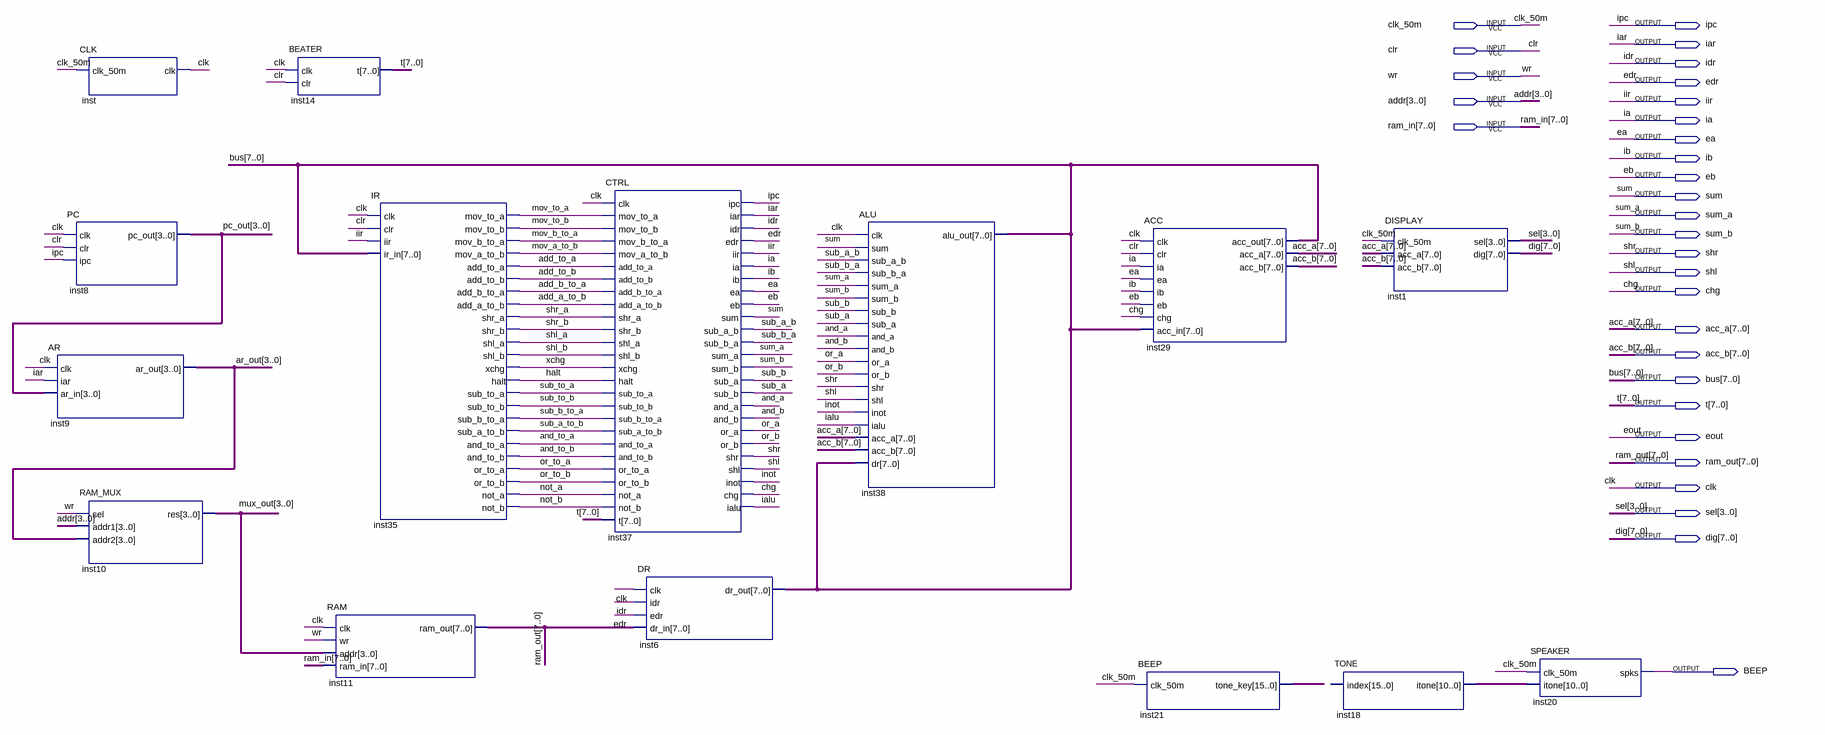
[diagram p0: schematic sheet]
// Quartus schematic COMPUTER.bdf as structural Verilog: 15 symbols, 30 pins
module COMPUTER (
  input  clk_50m,
  input  clr,
  input  wr,
  input  [3:0] addr,
  input  [7:0] ram_in,
  output ipc,
  output iar,
  output idr,
  output edr,
  output iir,
  output ia,
  output ea,
  output ib,
  output eb,
  output sum,
  output sum_a,
  output sum_b,
  output shr,
  output shl,
  output chg,
  output [7:0] acc_a,
  output [7:0] acc_b,
  output [7:0] bus,
  output [7:0] t,
  output eout,
  output [7:0] ram_out,
  output clk,
  output [3:0] sel,
  output [7:0] dig,
  output BEEP
);

  wire add_a_to_b, add_b_to_a, add_to_a, add_to_b, and_a, and_b, and_to_a, and_to_b, halt, ialu, inot,
       mov_a_to_b, mov_b_to_a, mov_to_a, mov_to_b, not_a, not_b, or_a, or_b, or_to_a, or_to_b, shl_a, shl_b,
       shr_a, shr_b, sub_a, sub_a_b, sub_a_to_b, sub_b, sub_b_a, sub_b_to_a, sub_to_a, sub_to_b, xchg;
  wire [3:0] ar_out, mux_out, pc_out;
  wire [10:0] inst18_itone;
  wire [15:0] inst21_tone_key;

  PC inst8 (.clk(clk), .clr(clr), .ipc(ipc), .pc_out(pc_out));
  AR inst9 (.clk(clk), .iar(iar), .ar_in(pc_out), .ar_out(ar_out));
  CLK inst (.clk_50m(clk_50m), .clk(clk));
  RAM_MUX inst10 (.sel(wr), .addr1(addr), .addr2(ar_out), .res(mux_out));
  BEATER inst14 (.clk(clk), .clr(clr), .t(t));
  IR inst35 (
    .clk(clk), .clr(clr), .iir(iir), .ir_in(bus), .mov_to_a(mov_to_a), .mov_to_b(mov_to_b),
    .mov_b_to_a(mov_b_to_a), .mov_a_to_b(mov_a_to_b), .add_to_a(add_to_a), .add_to_b(add_to_b),
    .add_b_to_a(add_b_to_a), .add_a_to_b(add_a_to_b), .shr_a(shr_a), .shr_b(shr_b), .shl_a(shl_a),
    .shl_b(shl_b), .xchg(xchg), .halt(halt), .sub_to_a(sub_to_a), .sub_to_b(sub_to_b),
    .sub_b_to_a(sub_b_to_a), .sub_a_to_b(sub_a_to_b), .and_to_a(and_to_a), .and_to_b(and_to_b),
    .or_to_a(or_to_a), .or_to_b(or_to_b), .not_a(not_a), .not_b(not_b));
  RAM inst11 (.clk(clk), .wr(wr), .addr(mux_out), .ram_in(ram_in), .ram_out(ram_out));
  CTRL inst37 (
    .clk(clk), .mov_to_a(mov_to_a), .mov_to_b(mov_to_b), .mov_b_to_a(mov_b_to_a), .mov_a_to_b(mov_a_to_b),
    .add_to_a(add_to_a), .add_to_b(add_to_b), .add_b_to_a(add_b_to_a), .add_a_to_b(add_a_to_b),
    .shr_a(shr_a), .shr_b(shr_b), .shl_a(shl_a), .shl_b(shl_b), .xchg(xchg), .halt(halt),
    .sub_to_a(sub_to_a), .sub_to_b(sub_to_b), .sub_b_to_a(sub_b_to_a), .sub_a_to_b(sub_a_to_b),
    .and_to_a(and_to_a), .and_to_b(and_to_b), .or_to_a(or_to_a), .or_to_b(or_to_b), .not_a(not_a),
    .not_b(not_b), .t(t), .ipc(ipc), .iar(iar), .idr(idr), .edr(edr), .iir(iir), .ia(ia), .ib(ib), .ea(ea),
    .eb(eb), .sum(sum), .sub_a_b(sub_a_b), .sub_b_a(sub_b_a), .sum_a(sum_a), .sum_b(sum_b), .sub_a(sub_b),
    .sub_b(sub_a), .and_a(and_a), .and_b(and_b), .or_a(or_a), .or_b(or_b), .shr(shr), .shl(shl), .inot(inot),
    .chg(chg), .ialu(ialu));
  DR inst6 (.clk(clk), .idr(idr), .edr(edr), .dr_in(ram_out), .dr_out(bus));
  ALU inst38 (
    .clk(clk), .sum(sum), .sub_a_b(sub_a_b), .sub_b_a(sub_b_a), .sum_a(sum_a), .sum_b(sum_b), .sub_b(sub_b),
    .sub_a(sub_a), .and_a(and_a), .and_b(and_b), .or_a(or_a), .or_b(or_b), .shr(shr), .shl(shl), .inot(inot),
    .ialu(ialu), .acc_a(acc_a), .acc_b(acc_b), .dr(bus), .alu_out(bus));
  ACC inst29 (
    .clk(clk), .clr(clr), .ia(ia), .ea(ea), .ib(ib), .eb(eb), .chg(chg), .acc_in(bus), .acc_out(bus),
    .acc_a(acc_a), .acc_b(acc_b));
  BEEP inst21 (.clk_50m(clk_50m), .tone_key(inst21_tone_key));
  TONE inst18 (.itone(inst18_itone));  // open: index
  DISPLAY inst1 (.clk_50m(clk_50m), .acc_a(acc_a), .acc_b(acc_b), .sel(sel), .dig(dig));
  SPEAKER inst20 (.clk_50m(clk_50m), .itone(inst18_itone), .spks(BEEP));
endmodule
